# EAGLE design Oscillator Or Joystick Ambisonic Pan-Rotate (EAGLE 9.0.1)

## Sheet 1 of 4: SWINGER (1 OF 4) 1V/oct expo conv and the quad VCO
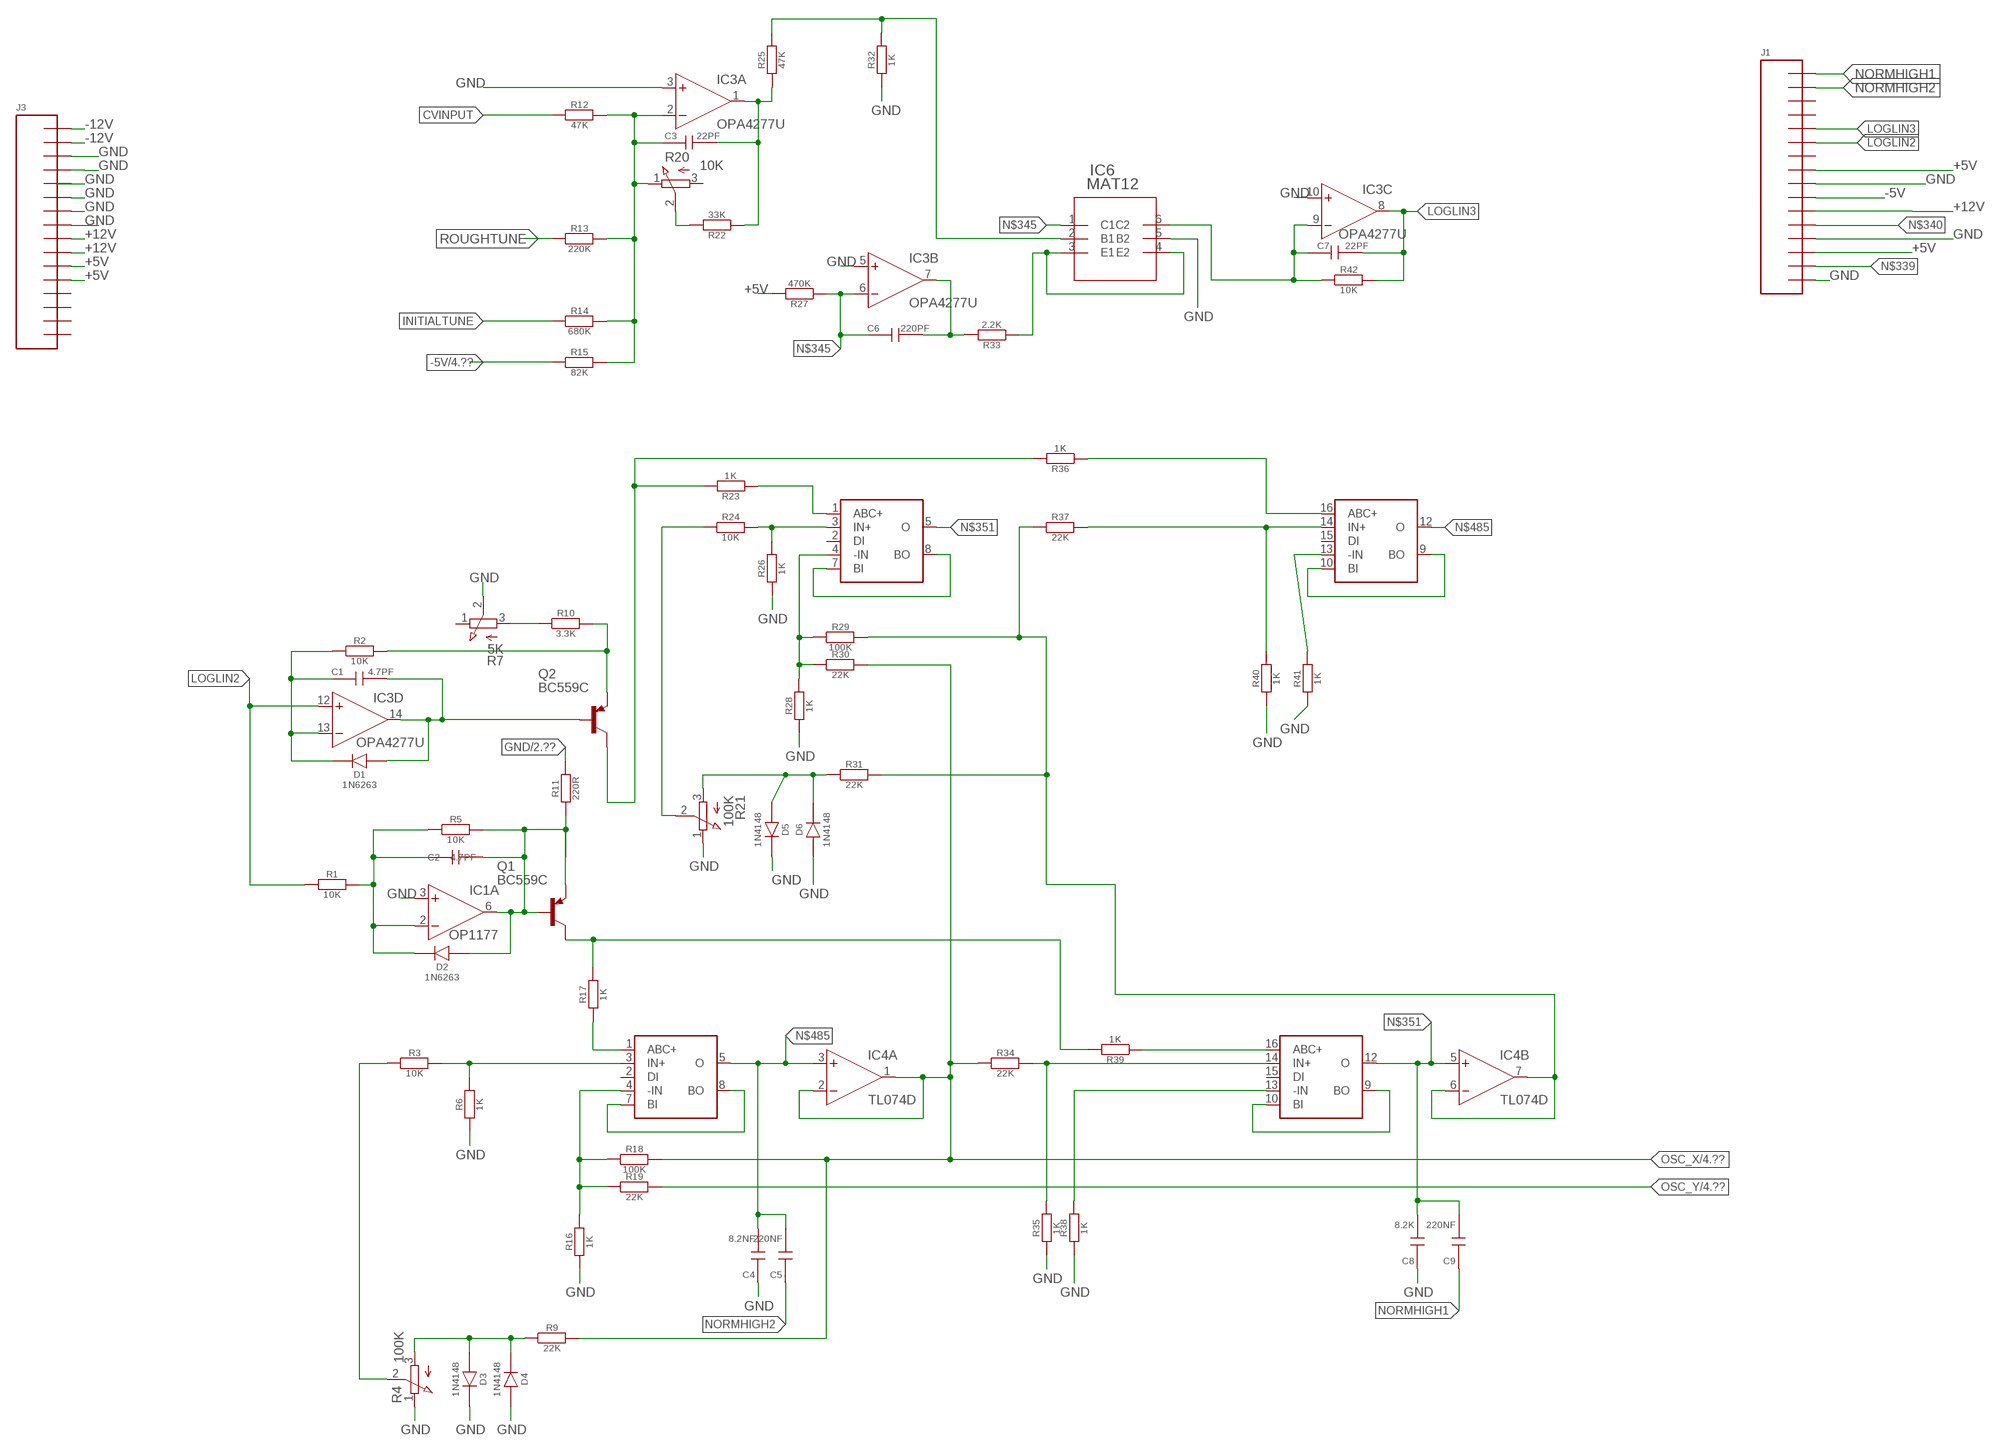
[diagram p0: schematic, sheet 1]

### Parts
C1  4.7PF  C  [CT6032]
C2  4.7PF  C  [CT6032]
C3  22PF  C  [CT6032]
C4  8.2NF  C  [CT6032]
C5  220NF  C  [CT6032]
C6  220PF  C  [CT6032]
C7  22PF  C  [CT6032]
C8  8.2K  C  [CT6032]
C9  220NF  C  [CT6032]
D1  1N6263  D  [SOD123]
D2  1N6263  D  [SOD123]
D3  1N4148  D  [SOD123]
D4  1N4148  D  [SOD123]
D5  1N4148  D  [SOD123]
D6  1N4148  D  [SOD123]
IC1  OP1177  [SO08]
IC2  LM13700  [SO16]
IC3  OPA4277U  [SO14]
IC4  TL074D  [SO14]
IC5  LM13700  [SO16]
IC6  MAT12  [H_6]
J1  CON_16  [2X08SMT]
J3  CON_16  [2X08SMT]
Q1  BC559C  [TO92]
Q2  BC559C  [TO92]
R1  10K  R  [R6332W]
R2  10K  R  [R6332W]
R3  10K  R  [R6332W]
R4  100K  TRIM  [TRIM]
R5  10K  R  [R6332W]
R6  1K  R  [R6332W]
R7  5K  TRIM  [TRIM]
R9  22K  R  [R6332W]
R10  3.3K  R  [R6332W]
R11  220R  R  [R6332W]
R12  47K  R  [R6332W]
R13  220K  R  [R6332W]
R14  680K  R  [R6332W]
R15  82K  R  [R6332W]
R16  1K  R  [R6332W]
R17  1K  R  [R6332W]
R18  100K  R  [R6332W]
R19  22K  R  [R6332W]
R20  10K  TRIM  [TRIM]
R21  100K  TRIM  [TRIM]
R22  33K  R  [R6332W]
R23  1K  R  [R6332W]
R24  10K  R  [R6332W]
R25  47K  R  [R6332W]
R26  1K  R  [R6332W]
R27  470K  R  [R6332W]
R28  1K  R  [R6332W]
R29  100K  R  [R6332W]
R30  22K  R  [R6332W]
R31  22K  R  [R6332W]
R32  1K  R  [R6332W]
R33  2.2K  R  [R6332W]
R34  22K  R  [R6332W]
R35  1K  R  [R6332W]
R36  1K  R  [R6332W]
R37  22K  R  [R6332W]
R38  1K  R  [R6332W]
R39  1K  R  [R6332W]
R40  1K  R  [R6332W]
R41  1K  R  [R6332W]
R42  10K  R  [R6332W]

### Nets
+5V: J1.8 J1.14 J3.11 J3.12 R27.2 ; also sheet 4
+12V: J1.11 J3.9 J3.10 ; also sheet 3,4
-5V: J1.10 R15.1 ; also sheet 4
-12V: J3.1 J3.2 ; also sheet 4
CVINPUT: R12.1
GND: C4.+ C8.+ D3.C D4.A D5.C D6.A IC1.3(A:+IN) IC3.3(A:+IN) IC3.5(B:+IN) IC3.10(C:+IN) IC6.5(B2) J1.9 J1.13 J1.16 J3.3 J3.4 J3.5 J3.6 J3.7 J3.8 R4.1(A) R6.1 R7.2(E) R11.2 R16.1 R21.1(A) R26.1 R28.1 R32.1 R35.1 R38.1 R40.1 R41.1 ; also sheet 2,3,4
INITIALTUNE: R14.1
LOGLIN2: IC3.12(D:+IN) J1.6 R1.1
LOGLIN3: C7.- IC3.8(C:OUT) J1.5 R42.2
N$283: C3.+ IC3.2(A:-IN) R12.2 R13.2 R14.2 R15.2 R20.1(A)
N$284: C3.- IC3.1(A:OUT) R22.1 R25.1
N$285: IC6.2(B1) R25.2 R32.2
N$286: C6.- IC3.7(B:OUT) R33.2
N$287: IC6.3(E1) IC6.4(E2) R33.1
N$290: C7.+ IC3.9(C:-IN) IC6.6(C2) R42.1
N$339: J1.15
N$340: J1.12
N$341: R20.2(E) R22.2
N$344: R7.3(S) R10.1
N$345: C6.+ IC3.6(B:-IN) IC6.1(C1) R27.1
N$347: R3.1 R4.2(E)
N$349: R21.2(E) R24.1
N$351: C8.- C9.- IC2.12(O) IC4.5(B:+IN) IC5.5(O)
N$380: C1.+ D1.C IC3.13(D:-IN) R2.1
N$384: C1.- D1.A IC3.14(D:OUT) Q2.B
N$399: C2.+ D2.C IC1.2(A:-IN) R1.2 R5.1
N$414: Q2.E R2.2 R10.2
N$418: C2.- D2.A IC1.6(A:OUT) Q1.B Q1.E R5.2 R11.1
N$419: Q2.C R23.2 R36.2
N$420: IC2.16(ABC+) R39.1
N$421: D3.A D4.C R4.3(S) R9.1
N$428: IC2.3(IN+) R3.2 R6.2
N$445: IC2.1(ABC+) R17.1
N$484: IC2.4(-IN) R16.2 R18.1 R19.1
N$485: C4.- C5.- IC2.5(O) IC4.3(A:+IN) IC5.12(O)
N$490: Q1.C R17.2 R39.2
N$491: IC2.7(BI) IC2.8(BO)
N$496: IC2.9(BO) IC2.10(BI)
N$514: IC2.14(IN+) R34.2 R35.2
N$532: IC2.13(-IN) R38.2
N$551: IC5.13(-IN) R41.2
N$575: IC5.3(IN+) R24.2 R26.2
N$577: IC5.4(-IN) R28.2 R29.1 R30.1
N$584: IC4.6(B:-IN) IC4.7(B:OUT) R29.2 R31.2 R37.1
N$596: IC5.9(BO) IC5.10(BI)
N$611: IC5.1(ABC+) R23.1
N$615: IC5.16(ABC+) R36.1
N$616: IC5.7(BI) IC5.8(BO)
N$617: IC5.14(IN+) R37.2 R40.2
N$618: D5.A D6.C R21.3(S) R31.1
NORMHIGH1: C9.+ J1.1
NORMHIGH2: C5.+ J1.2
OSC_X: IC4.1(A:OUT) IC4.2(A:-IN) R9.2 R18.2 R30.2 R34.1 ; also sheet 4
OSC_Y: R19.2 ; also sheet 4
ROUGHTUNE: R13.1
Unconnected: IC1.1(C:NC) IC1.5(D:NC) IC1.8(E:NC) IC2.2(DI) IC2.15(DI) IC4.8(C:OUT) IC4.9(C:-IN) IC4.10(C:+IN) IC4.12(D:+IN) IC4.13(D:-IN) IC4.14(D:OUT) IC5.2(DI) IC5.15(DI) J1.3 J1.4 J1.7 J3.13 J3.14 J3.15 J3.16 R7.1(A) R20.3(S)

## Sheet 2 of 4: SWINGER (2 OF 4) four precision current src to drive the OTA current inputs
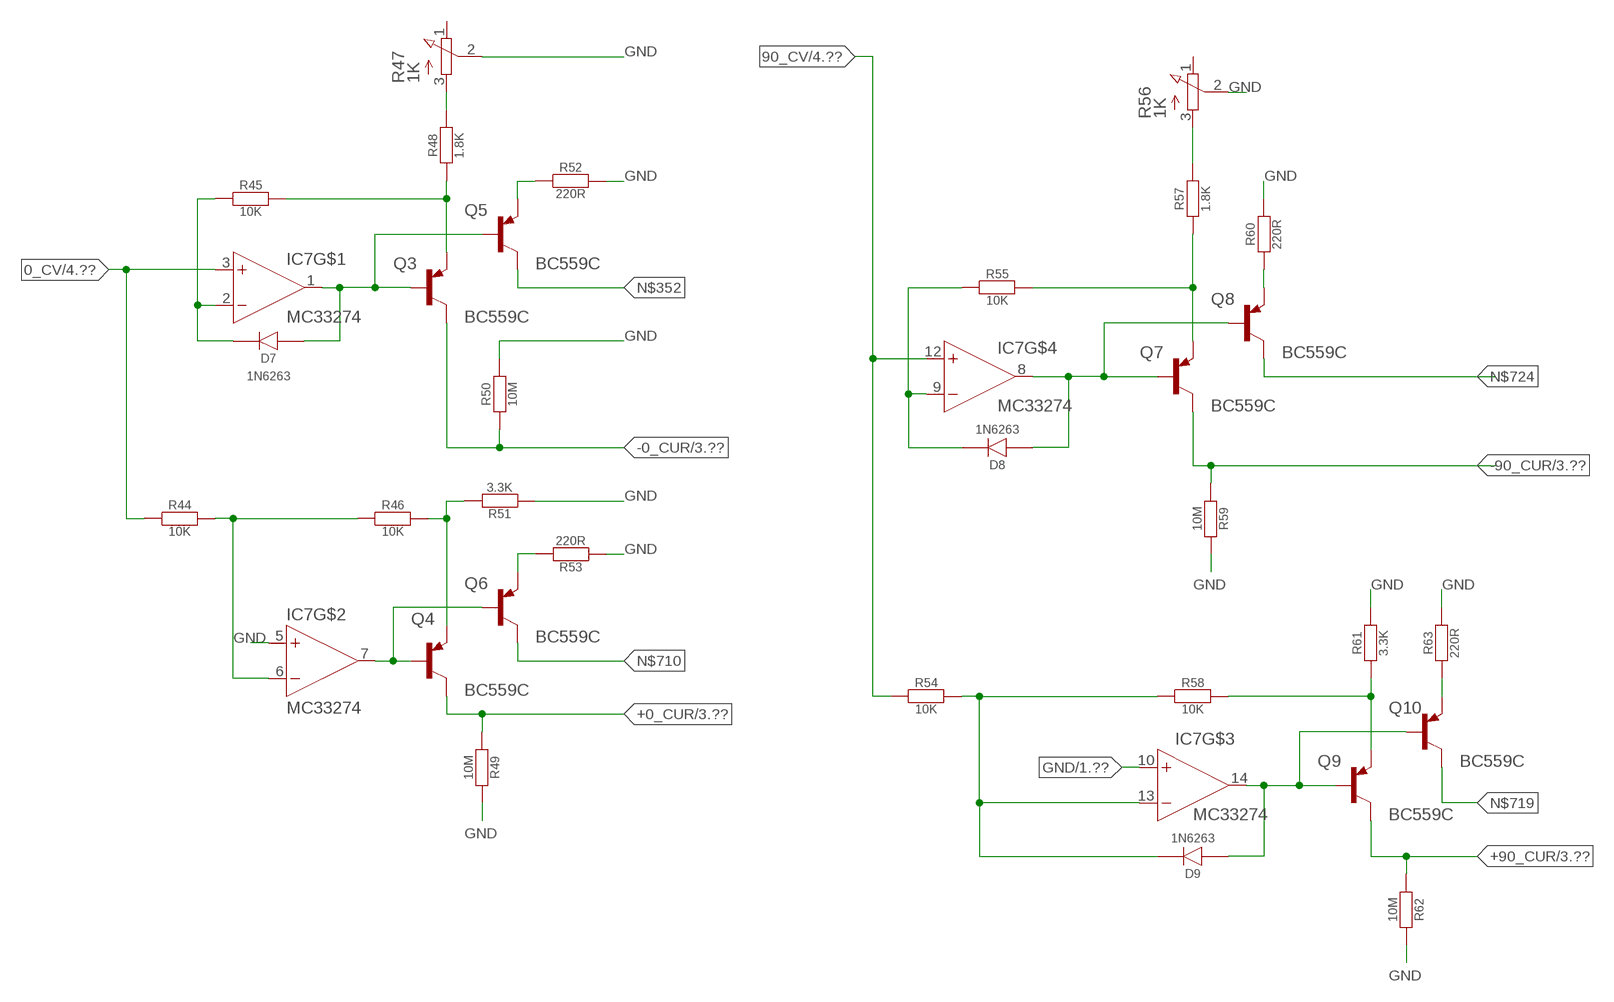
[diagram p1: schematic, sheet 2]

### Parts
D7  1N6263  D  [SOD123]
D8  1N6263  D  [SOD123]
D9  1N6263  D  [SOD123]
IC7  MC33274  [SO14]
Q3  BC559C  [TO92]
Q4  BC559C  [TO92]
Q5  BC559C  [TO92]
Q6  BC559C  [TO92]
Q7  BC559C  [TO92]
Q8  BC559C  [TO92]
Q9  BC559C  [TO92]
Q10  BC559C  [TO92]
R44  10K  R  [R6332W]
R45  10K  R  [R6332W]
R46  10K  R  [R6332W]
R47  1K  TRIM  [TRIM]
R48  1.8K  R  [R6332W]
R49  10M  R  [R6332W]
R50  10M  R  [R6332W]
R51  3.3K  R  [R6332W]
R52  220R  R  [R6332W]
R53  220R  R  [R6332W]
R54  10K  R  [R6332W]
R55  10K  R  [R6332W]
R56  1K  TRIM  [TRIM]
R57  1.8K  R  [R6332W]
R58  10K  R  [R6332W]
R59  10M  R  [R6332W]
R60  220R  R  [R6332W]
R61  3.3K  R  [R6332W]
R62  10M  R  [R6332W]
R63  220R  R  [R6332W]

### Nets
0_CV: IC7.3(+IN) R44.1 ; also sheet 4
90_CV: IC7.12(+IN) R54.1 ; also sheet 4
+0_CUR: Q4.C R49.1 ; also sheet 3
+90_CUR: Q9.C R62.1 ; also sheet 3
-0_CUR: Q3.C R50.1 ; also sheet 3
-90_CUR: Q7.C R59.1 ; also sheet 3
GND: IC7.5(+IN) IC7.10(+IN) R47.2(E) R49.2 R50.2 R51.1 R52.2 R53.1 R56.2(E) R59.2 R60.2 R61.2 R62.2 R63.2 ; also sheet 1,3,4
N$348: Q5.E R52.1
N$352: Q5.C
N$353: R56.3(S) R57.2
N$698: IC7.6(-IN) R44.2 R46.1
N$701: IC7.7(OUT) Q4.B Q6.B
N$702: Q4.E R46.2 R51.2
N$703: Q6.E R53.2
N$704: D7.A IC7.1(OUT) Q3.B Q5.B
N$705: R47.3(S) R48.2
N$706: D7.C IC7.2(-IN) R45.1
N$708: Q3.E R45.2 R48.1
N$710: Q6.C
N$711: D9.C IC7.13(-IN) R54.2 R58.1
N$712: D9.A IC7.14(OUT) Q9.B Q10.B
N$716: Q9.E R58.2 R61.1
N$717: Q10.E R63.1
N$719: Q10.C
N$720: D8.C IC7.9(-IN) R55.1
N$721: D8.A IC7.8(OUT) Q7.B Q8.B
N$722: Q7.E R55.2 R57.1
N$724: Q8.C
N$725: Q8.E R60.1
Unconnected: R47.1(A) R56.1(A)

## Sheet 3 of 4: SWINGER (3 Of 4) VCAs which provide the X-Y multiplication of the mono input signal
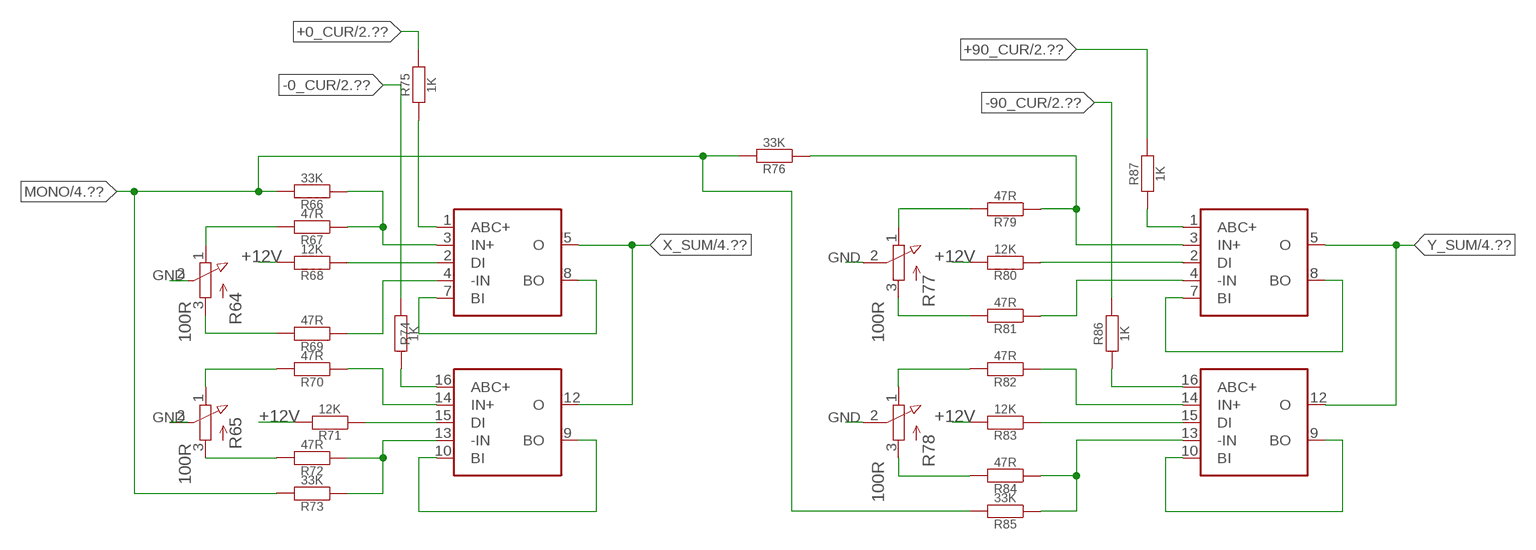
[diagram p2: schematic, sheet 3]

### Parts
IC8  LM13700  [SO16]
IC9  LM13700  [SO16]
R64  100R  TRIM  [TRIM]
R65  100R  TRIM  [TRIM]
R66  33K  R  [R6332W]
R67  47R  R  [R6332W]
R68  12K  R  [R6332W]
R69  47R  R  [R6332W]
R70  47R  R  [R6332W]
R71  12K  R  [R6332W]
R72  47R  R  [R6332W]
R73  33K  R  [R6332W]
R74  1K  R  [R6332W]
R75  1K  R  [R6332W]
R76  33K  R  [R6332W]
R77  100R  TRIM  [TRIM]
R78  100R  TRIM  [TRIM]
R79  47R  R  [R6332W]
R80  12K  R  [R6332W]
R81  47R  R  [R6332W]
R82  47R  R  [R6332W]
R83  12K  R  [R6332W]
R84  47R  R  [R6332W]
R85  33K  R  [R6332W]
R86  1K  R  [R6332W]
R87  1K  R  [R6332W]

### Nets
+0_CUR: R75.2 ; also sheet 2
+12V: R68.2 R71.2 R80.2 R83.2 ; also sheet 1,4
+90_CUR: R87.2 ; also sheet 2
-0_CUR: R74.2 ; also sheet 2
-90_CUR: R86.2 ; also sheet 2
GND: R64.2(E) R65.2(E) R77.2(E) R78.2(E) ; also sheet 1,2,4
MONO: R66.2 R73.2 R76.2 R85.2 ; also sheet 4
N$668: IC8.1(ABC+) R75.1
N$669: IC8.16(ABC+) R74.1
N$670: IC8.3(IN+) R66.1 R67.1
N$671: IC8.2(DI) R68.1
N$672: IC8.4(-IN) R69.1
N$673: IC8.7(BI) IC8.8(BO)
N$675: IC8.9(BO) IC8.10(BI)
N$676: IC8.14(IN+) R70.1
N$677: IC8.15(DI) R71.1
N$678: IC8.13(-IN) R72.1 R73.1
N$679: R65.3(S) R72.2
N$680: R65.1(A) R70.2
N$682: R64.3(S) R69.2
N$683: R64.1(A) R67.2
N$684: R77.3(S) R81.2
N$685: R77.1(A) R79.2
N$686: R78.3(S) R84.2
N$687: R78.1(A) R82.2
N$688: IC9.14(IN+) R82.1
N$689: IC9.13(-IN) R84.1 R85.1
N$690: IC9.15(DI) R83.1
N$691: IC9.16(ABC+) R86.1
N$692: IC9.4(-IN) R81.1
N$693: IC9.3(IN+) R76.1 R79.1
N$694: IC9.2(DI) R80.1
N$695: IC9.7(BI) IC9.8(BO)
N$696: IC9.9(BO) IC9.10(BI)
N$699: IC9.1(ABC+) R87.1
X_SUM: IC8.5(O) IC8.12(O) ; also sheet 4
Y_SUM: IC9.5(O) IC9.12(O) ; also sheet 4

## Sheet 4 of 4: SWINGER (4 OF 4) auxilliary circuits common to all sections
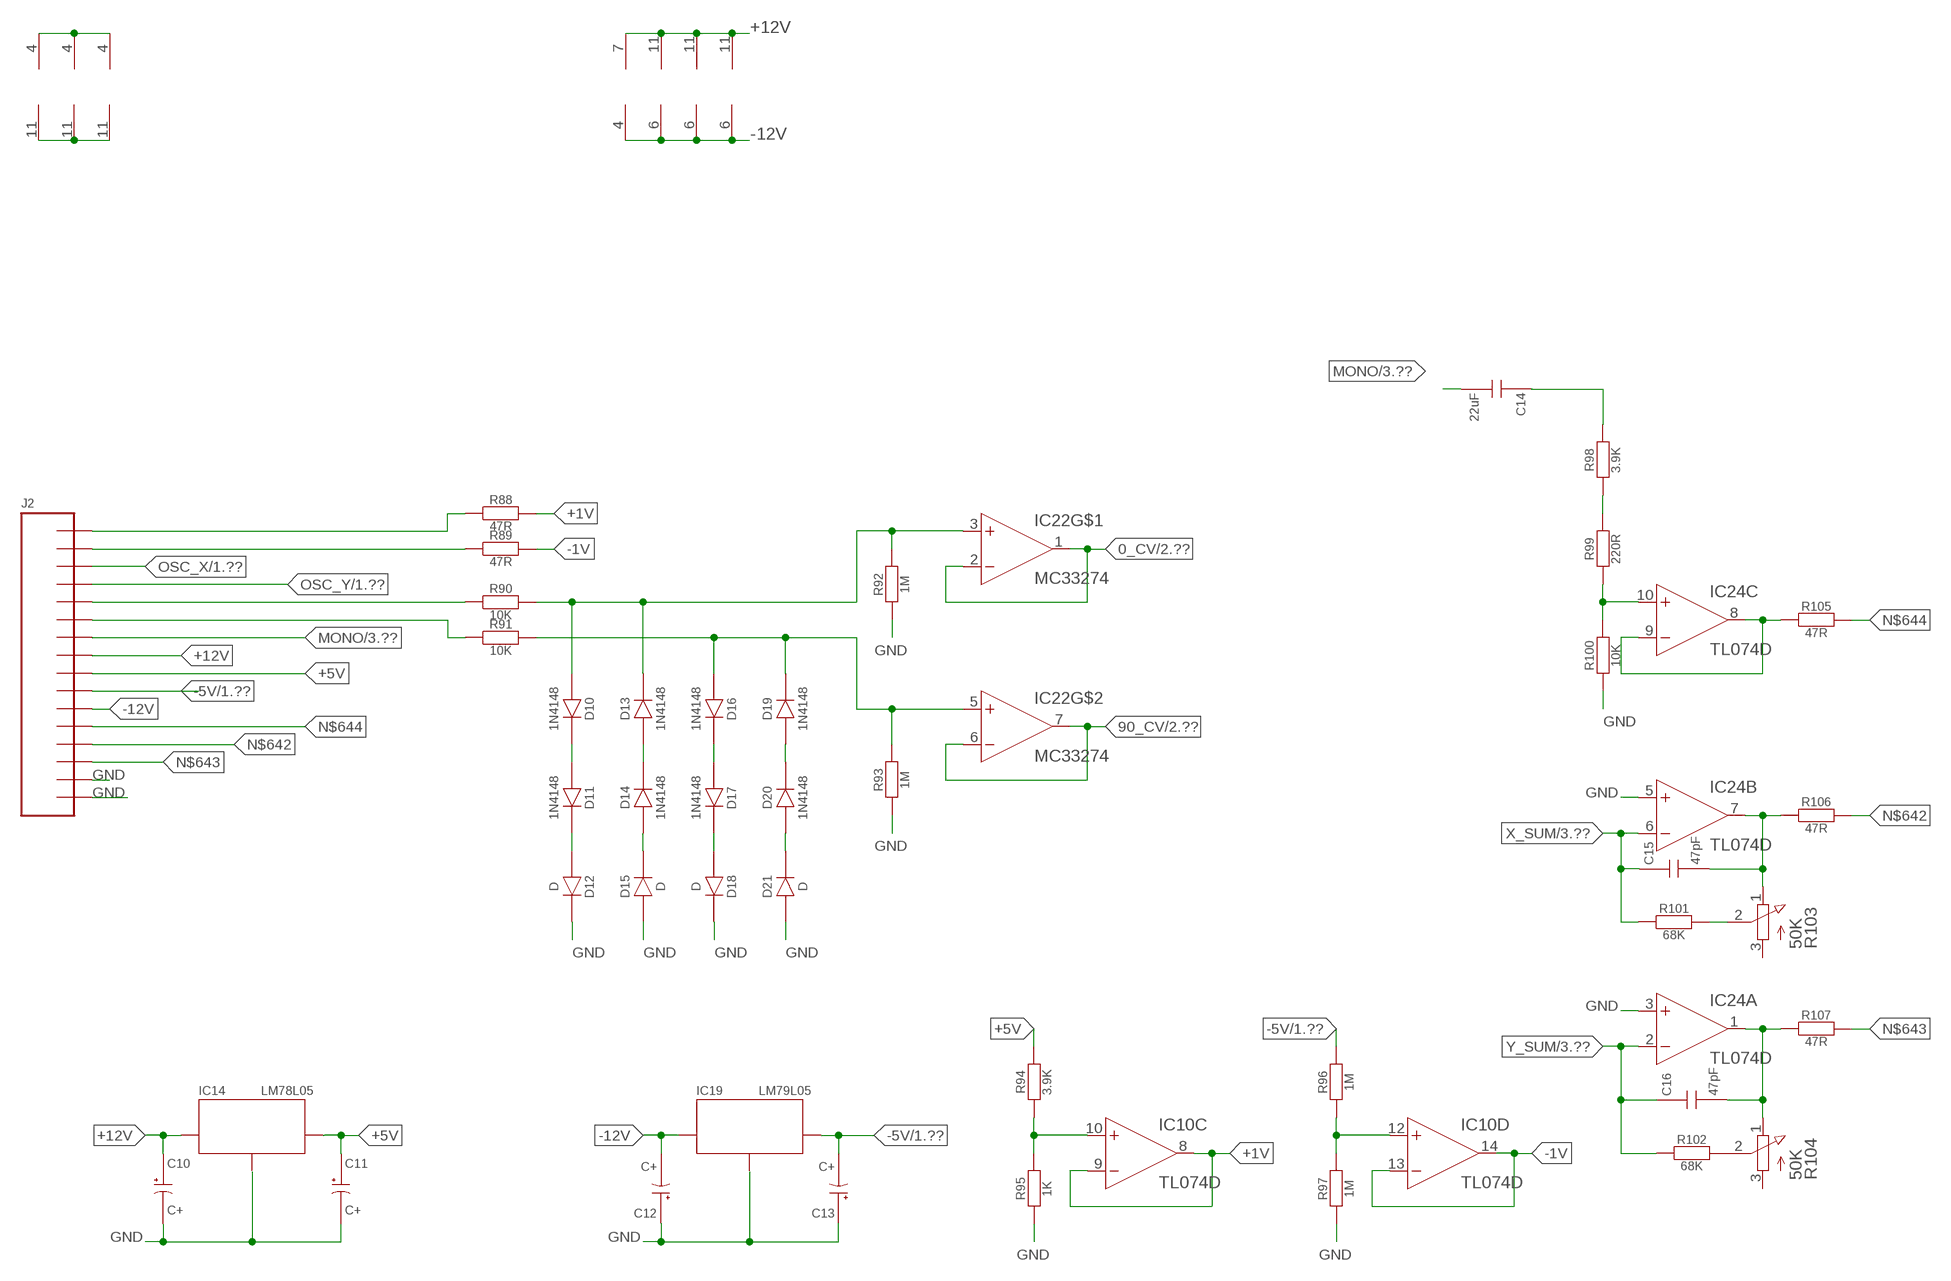
[diagram p3: schematic, sheet 4]

### Parts
C10  C+  [PANASONIC_E]
C11  C+  [PANASONIC_E]
C12  C+  [PANASONIC_E]
C13  C+  [PANASONIC_E]
C14  22uF  C  [CT6032]
C15  47pF  C  [CT6032]
C16  47pF  C  [CT6032]
D10  1N4148  D  [SOD123]
D11  1N4148  D  [SOD123]
D12  D  [SOD123]
D13  1N4148  D  [SOD123]
D14  1N4148  D  [SOD123]
D15  D  [SOD123]
D16  1N4148  D  [SOD123]
D17  1N4148  D  [SOD123]
D18  D  [SOD123]
D19  1N4148  D  [SOD123]
D20  1N4148  D  [SOD123]
D21  D  [SOD123]
IC10  TL074D  [SO14]
IC14  LM78L05  VREG  [SO08]
IC19  LM79L05  VREG  [SO08]
IC22  MC33274  [SO14]
IC24  TL074D  [SO14]
J2  CON_16  [2X08SMT]
R88  47R  R  [R6332W]
R89  47R  R  [R6332W]
R90  10K  R  [R6332W]
R91  10K  R  [R6332W]
R92  1M  R  [R6332W]
R93  1M  R  [R6332W]
R94  3.9K  R  [R6332W]
R95  1K  R  [R6332W]
R96  1M  R  [R6332W]
R97  1M  R  [R6332W]
R98  3.9K  R  [R6332W]
R99  220R  R  [R6332W]
R100  10K  R  [R6332W]
R101  68K  R  [R6332W]
R102  68K  R  [R6332W]
R103  50K  TRIM  [TRIM]
R104  50K  TRIM  [TRIM]
R105  47R  R  [R6332W]
R106  47R  R  [R6332W]
R107  47R  R  [R6332W]

### Nets
0_CV: IC22.1(OUT) IC22.2(-IN) ; also sheet 2
90_CV: IC22.6(-IN) IC22.7(OUT) ; also sheet 2
+1V: IC10.8(C:OUT) IC10.9(C:-IN) R88.2
+5V: C11.+ IC14.1(OUT) J2.9 R94.2 ; also sheet 1
+12V: C10.+ IC1.7(B:V+) IC3.4(E:V+) IC5.11(V+) IC7.4(V+) IC8.11(V+) IC9.11(V+) IC14.8(IN) IC24.4(P:V+) J2.8 ; also sheet 1,3
-1V: IC10.13(D:-IN) IC10.14(D:OUT) R89.2
-5V: C13.- IC19.1(OUT) J2.10 R96.2 ; also sheet 1
-12V: C12.- IC1.4(B:V-) IC3.11(E:V-) IC5.6(V-) IC7.11(V-) IC8.6(V-) IC9.6(V-) IC19.8(IN) IC24.11(P:V-) J2.11 ; also sheet 1
GND: C10.- C11.- C12.+ C13.+ D12.C D15.A D18.C D21.A IC14.2(GND) IC14.3(GND) IC14.6(GND) IC14.7(GND) IC19.2(GND) IC19.3(GND) IC19.6(GND) IC19.7(GND) IC24.3(A:+IN) IC24.5(B:+IN) J2.15 J2.16 R92.1 R93.1 R95.1 R97.1 R100.1 ; also sheet 1,2,3
MONO: C14.- J2.7 ; also sheet 3
N$1: C14.+ R98.2
N$350: R98.1 R99.2
N$356: C15.- IC24.7(B:OUT) R103.1(A) R106.1
N$357: IC10.10(C:+IN) R94.1 R95.2
N$358: J2.1 R88.1
N$359: IC10.12(D:+IN) R96.1 R97.2
N$362: J2.2 R89.1
N$363: J2.5 R90.1
N$364: J2.6 R91.1
N$621: IC24.10(C:+IN) R99.1 R100.2
N$622: IC24.8(C:OUT) IC24.9(C:-IN) R105.1
N$641: R101.2 R103.2(E)
N$642: J2.13 R106.2
N$643: J2.14 R107.2
N$644: J2.12 R105.2
N$645: C16.- IC24.1(A:OUT) R104.1(A) R107.1
N$646: D10.C D11.A
N$648: R102.2 R104.2(E)
N$651: D11.C D12.A
N$652: D13.A D14.C
N$653: D14.A D15.C
N$654: D17.C D18.A
N$655: D16.C D17.A
N$656: D20.A D21.C
N$657: D19.A D20.C
N$658: D10.A D13.C IC22.3(+IN) R90.2 R92.2
N$659: D16.A D19.C IC22.5(+IN) R91.2 R93.2
OSC_X: J2.3 ; also sheet 1
OSC_Y: J2.4 ; also sheet 1
X_SUM: C15.+ IC24.6(B:-IN) R101.1 ; also sheet 3
Y_SUM: C16.+ IC24.2(A:-IN) R102.1 ; also sheet 3
Unconnected: IC10.1(A:OUT) IC10.2(A:-IN) IC10.3(A:+IN) IC10.5(B:+IN) IC10.6(B:-IN) IC10.7(B:OUT) IC22.8(OUT) IC22.9(-IN) IC22.10(+IN) IC22.12(+IN) IC22.13(-IN) IC22.14(OUT) IC24.12(D:+IN) IC24.13(D:-IN) IC24.14(D:OUT) R103.3(S) R104.3(S)

## Power pins joined to a net without a drawn wire
+12V: IC2.11(V+) IC4.4(P:V+) IC10.4(P:V+) IC22.4(V+)
-12V: IC2.6(V-) IC4.11(P:V-) IC10.11(P:V-) IC22.11(V-)

## Library data of the parts
C1-C9 C14-C16 = SMD:C
C10-C13 = SMD:C+
D1-D21 = SMD:D
IC1 = SMD:OP1177: Precision Low Noise, Low Input Bias Current Operational Amplifiers Source: OP1177_2177_4177.pdf
IC2 IC5 IC8 IC9 = SMD:LM13700
IC3 = SMD:OPA4277: High Precision OPERATIONAL AMPLIFIERS REPLACES OP-07, OP-77, OP-177 Source: opa277.pdf
IC4 IC10 IC24 = SMD:TL074: OP AMP
IC6 = SMD:MAT12; MANUFACTURER_PART_NUMBER: MAT12AHZ; VENDOR: Analog Devices Inc
IC7 IC22 = SMD:MC33274
IC14 IC19 = SMD:VREG
J1-J3 = SMD:CON_16
Q1-Q10 = SMD:BC559: PNP Transistror
R1-R3 R5 R6 R9-R19 R22-R42 R44-R46 R48-R55 R57-R63 R66-R76 R79-R102 R105-R107 = SMD:R
R4 R7 R20 R21 R47 R56 R64 R65 R77 R78 R103 R104 = SMD:TRIM

## Board
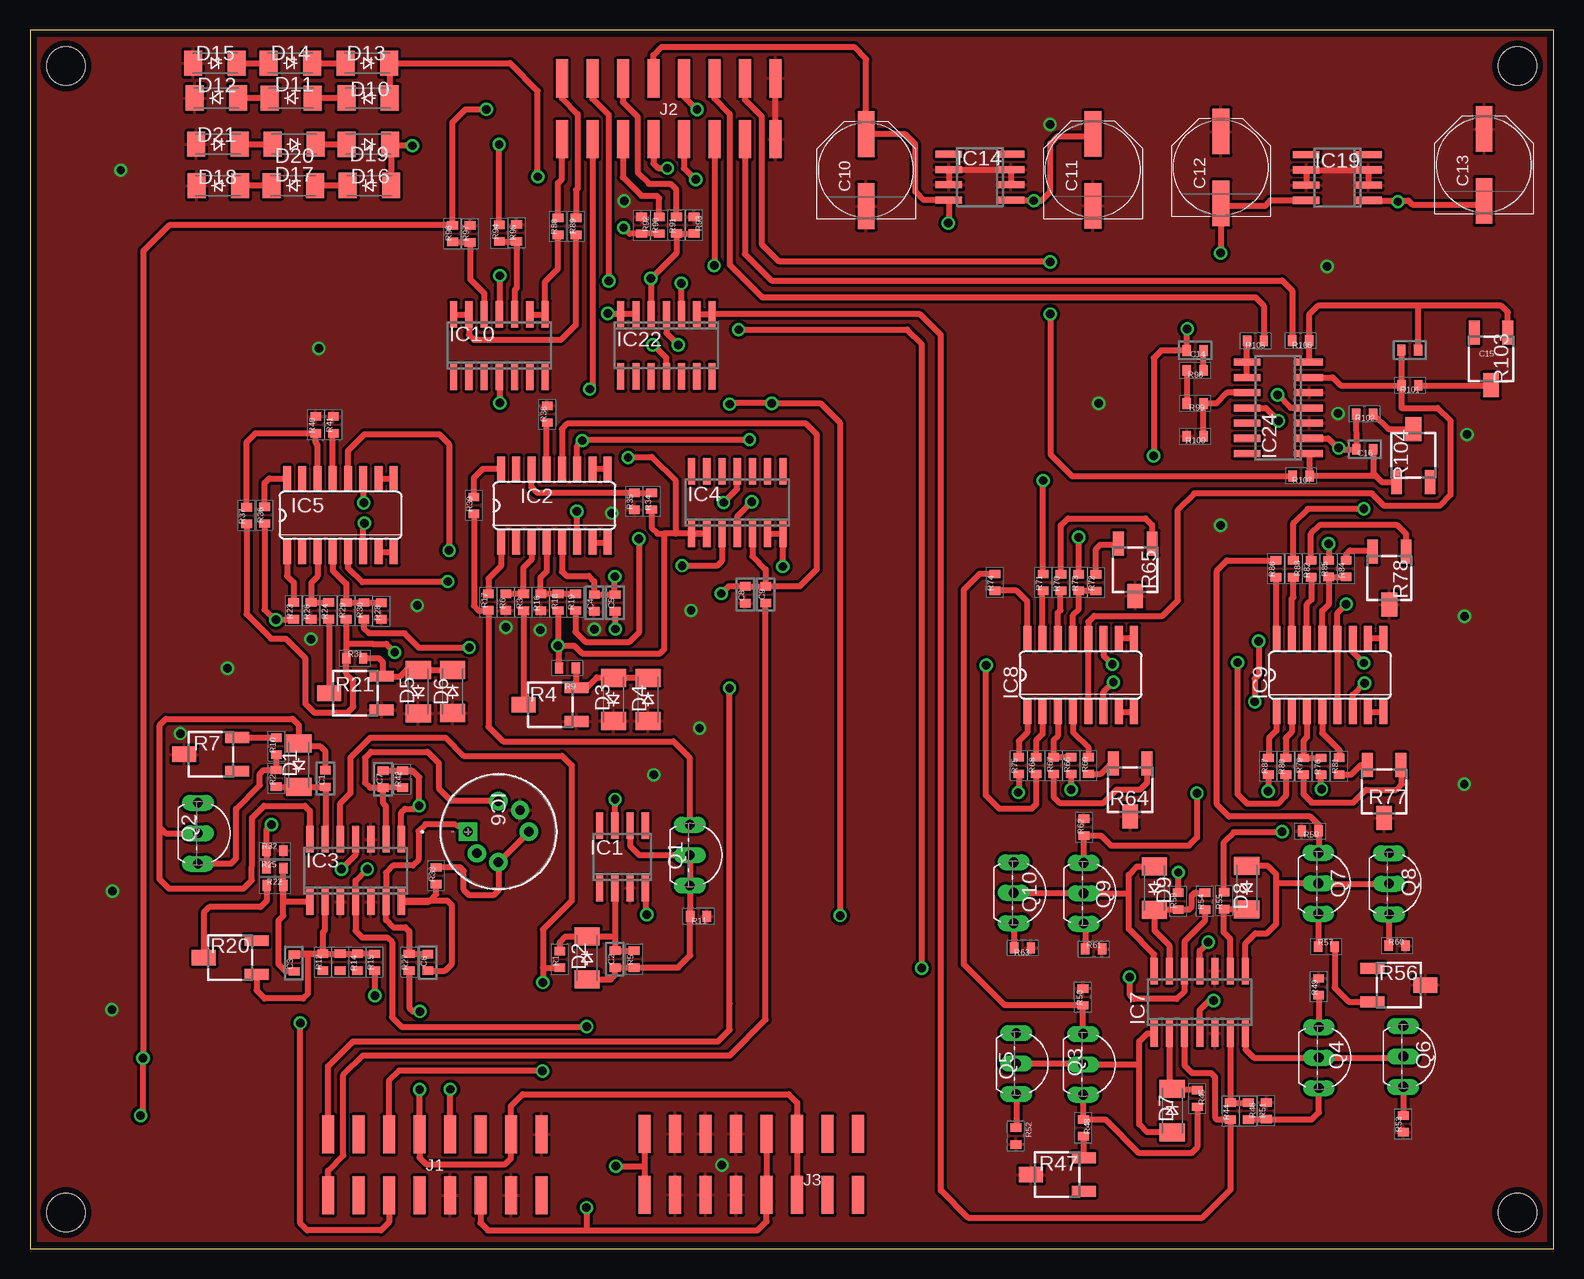
[diagram p4: board, top side]
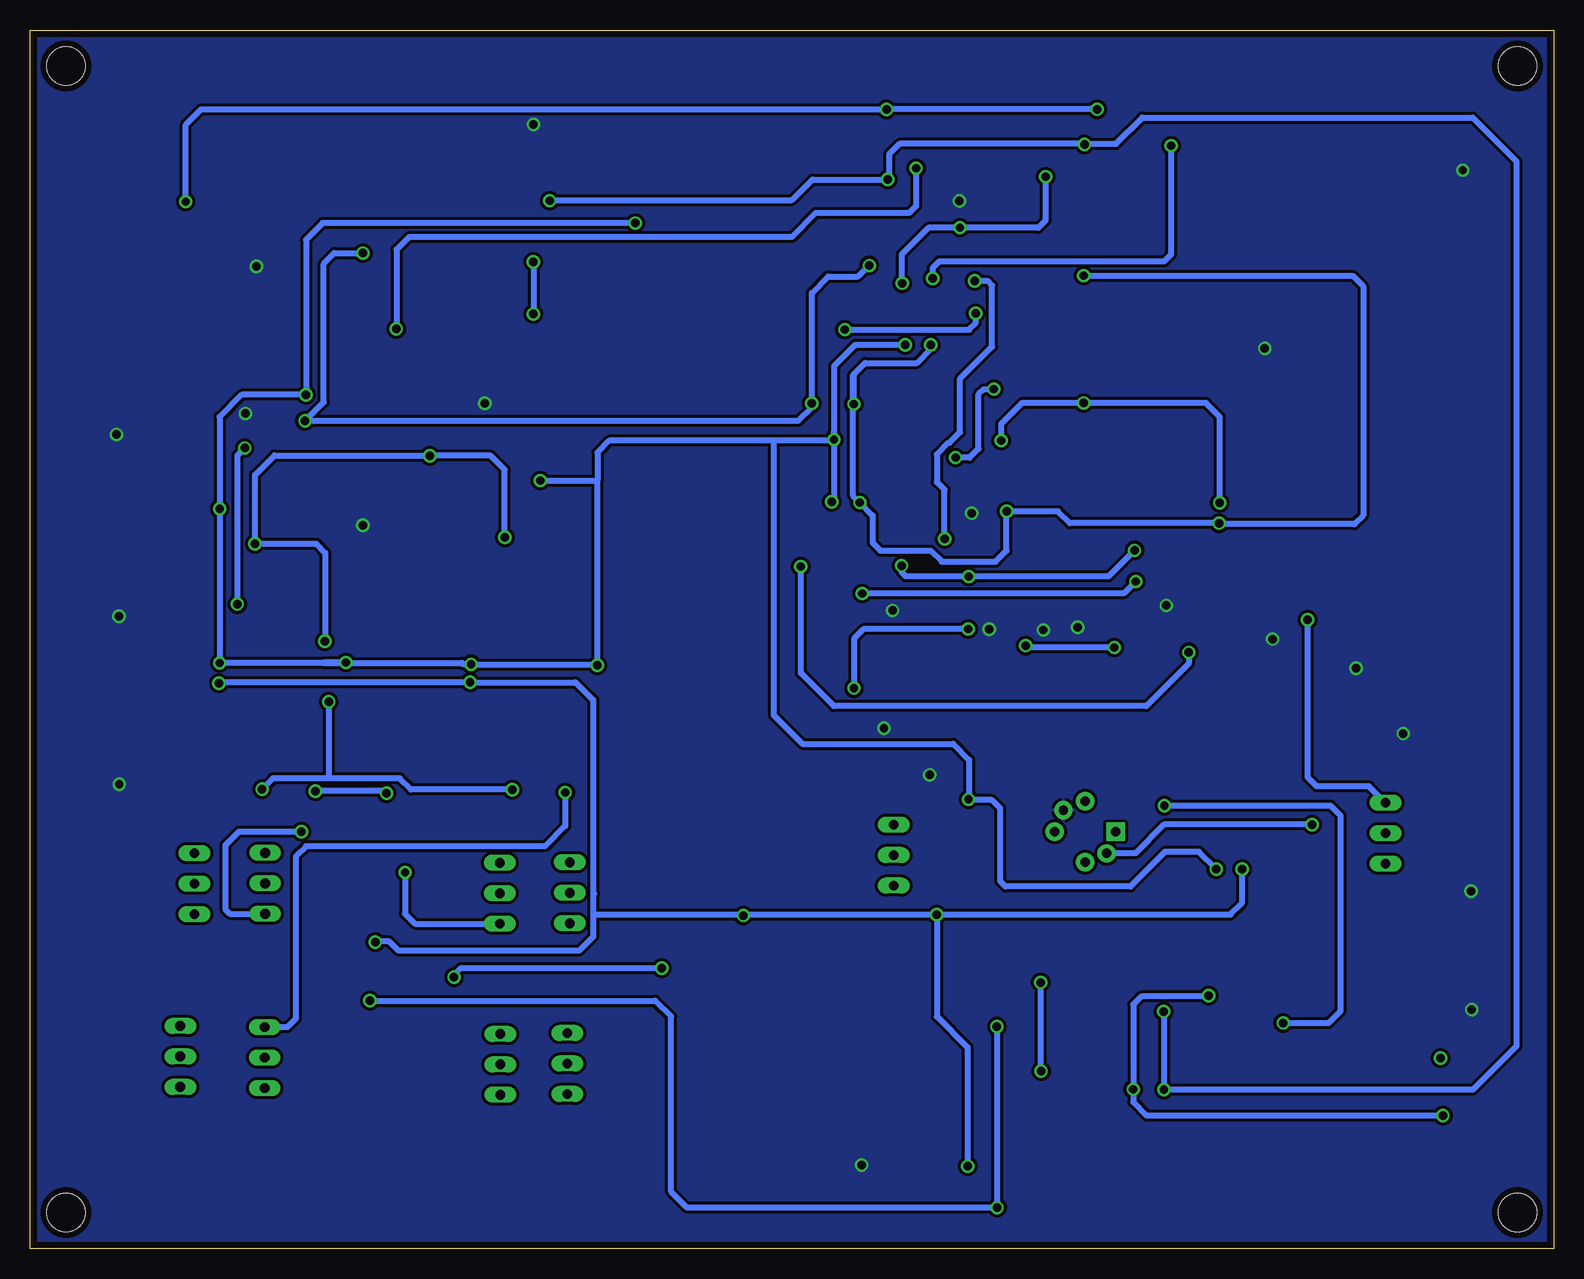
[diagram p5: board, bottom side, seen from below]

Size 127 x 101.6 mm. Coordinates in mm from the lower left corner, seen from the top.
Outline: 0,0 127,0 127,101.6 0,101.6 0,0
Copper layers (1*16): Top 0.035mm / dielectric 1.5mm / Bottom 0.035mm
Design rules "default *": minimum track width 3mil, minimum drill 0.35mm, track to track 10mil, track to pad 15mil, pad to pad 10mil, via to via 8mil, smd to smd 6mil, copper to edge 20mil, drill to drill 6mil, minimum pad ring 10mil, minimum via ring 8mil, stop-mask expansion 4mil, vias tented up to drill 0mil, thermal gap 10mil
Holes 3.2 mm at 3,3 3,98.6 124,98.6 124,3

### Footprints (pad centres in the part's own frame; a part is rotated, then mirrored left to right if it is on the bottom)
CT6032 = smd 0.7 x 0.9: + -0.7,0; - 0.7,0
PANASONIC_E = smd 3.8 x 1.4: + 3,0; - -3,0
SOD123 = smd 1.5 x 2.1: A 1.8,0; C -1.8,0
SO08 = smd 0.6 x 2.2: 1 -1.905,-2.6; 2 -0.635,-2.6; 3 0.635,-2.6; 4 1.905,-2.6; 5 1.905,2.6; 6 0.635,2.6; 7 -0.635,2.6; 8 -1.905,2.6
SO16 = smd 0.66 x 2.032: 1 -4.445,-3.073; 2 -3.175,-3.073; 3 -1.905,-3.073; 4 -0.635,-3.073; 5 0.635,-3.073; 6 1.905,-3.073; 7 3.175,-3.073; 8 4.445,-3.073; 9 4.445,3.073; 10 3.175,3.073; 11 1.905,3.073; 12 0.635,3.073; 13 -0.635,3.073; 14 -1.905,3.073; 15 -3.175,3.073; 16 -4.445,3.073
SO14 = smd 0.6 x 2.2: 1 -3.81,-2.6; 2 -2.54,-2.6; 3 -1.27,-2.6; 4 0,-2.6; 5 1.27,-2.6; 6 2.54,-2.6; 7 3.81,-2.6; 8 3.81,2.6; 9 2.54,2.6; 10 1.27,2.6; 11 0,2.6; 12 -1.27,2.6; 13 -2.54,2.6; 14 -3.81,2.6
H_6 = drill 0.787 pad 1.524 square: 1 0,-5.08 | drill 0.787 pad 1.524: 2 1.803,-4.343; 3 2.54,-2.54; 4 0,0; 5 -1.803,-0.737; 6 -2.54,-2.54
2X08SMT = smd 1 x 3.17: 1 -8.89,-2.54; 2 -8.89,2.54; 3 -6.35,-2.54; 4 -6.35,2.54; 5 -3.81,-2.54; 6 -3.81,2.54; 7 -1.27,-2.54; 8 -1.27,2.54; 9 1.27,-2.54; 10 1.27,2.54; 11 3.81,-2.54; 12 3.81,2.54; 13 6.35,-2.54; 14 6.35,2.54; 15 8.89,-2.54; 16 8.89,2.54
TO92 = drill 0.813 long: B 0,-1.27; C -2.54,-1.27; E 2.54,-1.27
R6332W = smd 0.7 x 0.9: 1 -0.7,0; 2 0.7,0
TRIM = smd 2 x 0.9: 1 -2.2,1.4; 3 -2.2,-1.4 | smd 2 x 1.3: 2 2.2,0

### Placement (x,y rotation side)
C1  24.63,39.2 90 top
C2  48.76,24.15 270 top
C3  22.01,23.82 270 top
C4  47.04,53.84 90 top
C5  48.77,53.84 90 top
C6  33.17,23.87 270 top
C7  29.44,39.14 90 top
C8  59.62,54.52 90 top
C9  61.33,54.53 90 top
C10  69.7,89.91 90 top
C11  88.61,89.94 90 top
C12  99.28,90.14 90 top
C13  121.21,90.35 90 top
C14  97.13,74.88 180 top
C15  115.01,74.91 0 top
C16  111.26,66.64 0 top
D1  22.41,40.31 90 top
D2  46.44,24.24 270 top
D3  48.64,45.8 90 top
D4  51.52,45.79 270 top
D5  32.37,46.44 90 top
D6  35.23,46.45 270 top
D7  95.21,11.51 270 top
D8  101.42,30.1 90 top
D9  93.74,30.06 90 top
D10  28.19,95.93 0 top
D11  21.78,95.92 0 top
D12  15.54,95.93 0 top
D13  28.12,98.83 180 top
D14  21.71,98.84 180 top
D15  15.42,98.83 180 top
D16  28.29,88.64 0 top
D17  21.95,88.63 0 top
D18  15.7,88.62 0 top
D19  28.21,92.06 180 top
D20  22.01,92.08 180 top
D21  15.67,92.07 180 top
IC1  49.39,32.66 0 top
IC2  43.71,61.95 0 top
IC3  27.14,31.53 0 top
IC4  58.95,62.2 0 top
IC5  25.88,61.15 0 top
IC6  41.59,34.76 270 top
IC7  97.51,20.55 0 top
IC8  87.58,47.83 0 top
IC9  108.36,47.82 0 top
IC10  39.13,75.29 0 top
IC14  79.19,89.33 90 top
IC19  108.98,89.29 90 top
IC22  53.05,75.31 180 top
IC24  104.05,70.09 90 top
J1  33.74,6.99 0 top
J2  53.24,95.02 0 top
J3  60.13,7.03 0 top
Q1  56.28,32.81 270 top
Q2  15.28,34.64 270 top
Q3  89.07,15.37 270 top
Q4  108.71,15.93 270 top
Q5  83.48,15.44 270 top
Q6  115.74,16.03 270 top
Q7  108.67,30.46 270 top
Q8  114.56,30.43 270 top
Q9  89.11,29.63 270 top
Q10  83.28,29.67 270 top
R1  44.17,24.12 90 top
R2  20.53,39.21 90 top
R3  41.14,53.89 90 top
R4  43.36,45.36 180 top
R5  50.36,24.14 270 top
R6  39.67,53.91 90 top
R7  15.07,41.21 180 top
R9  44.8,48.41 180 top
R10  20.54,41.89 270 top
R11  55.73,27.71 0 top
R12  24.42,23.9 90 top
R13  25.86,23.89 90 top
R14  27.29,23.89 90 top
R15  28.73,23.88 90 top
R16  42.59,53.89 90 top
R17  38.21,53.91 270 top
R18  44.03,53.9 270 top
R19  45.47,53.9 270 top
R20  16.69,24.28 180 top
R21  27.12,46.32 180 top
R22  20.43,30.28 180 top
R23  21.98,53.18 270 top
R24  24.9,53.18 90 top
R25  20.42,31.73 180 top
R26  23.44,53.19 90 top
R27  31.61,23.88 270 top
R28  29.29,53.16 90 top
R29  26.36,53.17 270 top
R30  27.83,53.17 270 top
R31  27.07,49.23 180 top
R32  20.41,33.19 180 top
R33  33.85,31.09 270 top
R34  51.82,62.32 90 top
R35  50.38,62.31 90 top
R36  19.56,61.15 270 top
R37  18.05,61.12 90 top
R38  43.12,69.57 270 top
R39  37,61.96 270 top
R40  23.83,68.69 270 top
R41  25.29,68.68 270 top
R42  31.05,39.15 90 top
R44  100.07,11.48 90 top
R45  97.3,12.53 270 top
R46  101.55,11.48 270 top
R47  85.64,6.18 180 top
R48  87.8,10.08 270 top
R49  107.42,21.84 90 top
R50  87.76,20.99 90 top
R51  103.05,11.5 270 top
R52  82.18,9.4 270 top
R53  114.47,10.41 90 top
R54  97.93,28.97 90 top
R55  99.54,29.01 90 top
R56  114.1,21.98 0 top
R57  108.06,25.18 0 top
R58  95.71,28.97 90 top
R59  106.72,34.82 180 top
R60  113.95,25.26 0 top
R61  88.67,24.99 0 top
R62  87.86,35.14 90 top
R63  82.74,25.08 0 top
R64  91.71,38.25 270 top
R65  92.14,56.6 270 top
R66  86.79,40.28 270 top
R67  85.33,40.28 270 top
R68  83.87,40.28 270 top
R69  88.23,40.28 270 top
R70  85.93,55.54 90 top
R71  84.45,55.55 90 top
R72  88.86,55.53 90 top
R73  87.42,55.54 90 top
R74  80.43,55.55 90 top
R75  82.42,40.28 270 top
R76  107.62,40.21 270 top
R77  112.88,38.12 270 top
R78  113.31,55.91 270 top
R79  106.15,40.21 270 top
R80  104.68,40.21 270 top
R81  109.13,40.23 270 top
R82  106.79,56.69 90 top
R83  105.32,56.68 90 top
R84  109.71,56.7 90 top
R85  108.25,56.7 90 top
R86  103.85,56.68 90 top
R87  103.22,40.21 270 top
R88  44.01,85.23 270 top
R89  45.52,85.22 270 top
R90  52.45,85.32 270 top
R91  53.89,85.33 270 top
R92  50.99,85.32 270 top
R93  55.35,85.33 270 top
R94  39.12,84.66 90 top
R95  40.57,84.68 270 top
R96  35.22,84.62 90 top
R97  36.69,84.6 270 top
R98  97.12,73.22 0 top
R99  97.13,70.46 180 top
R100  97.12,67.73 0 top
R101  115.03,71.97 0 top
R102  111.25,69.59 0 top
R103  121.79,74.19 270 top
R104  115.31,66.13 90 top
R105  102.15,75.69 0 top
R106  105.92,75.7 180 top
R107  105.96,64.42 180 top

### Tracks (layer width: path | path; a pad name or v marks a point on that pad's centre or on a via)
0_CV
  Top 0.5: IC22.2 IC22.1 74.19,77.91 75.92,76.17 75.92,4.87 78.19,2.6 97.74,2.6 100.07,4.93 R44.1 98.93,10.78 98.79,10.92 98.79,14.31 98.44,14.66 96.87,14.66 96.24,15.29 IC7.3
90_CV  (via drill 0.7)
  Top 0.5: R54.1 97.93,27.32 96.24,25.63 IC7.12 96.24,21.47 95.58,20.81 92.03,20.81 91.7,21.14 91.7,22.59 | 91.7,22.59 91.7,22.75 | v91.65,22.64 91.7,22.59 | IC22.6 IC22.7 48.22,77.91 v48.16,77.97 | v74.34,23.39 74.34,75.41 73.11,76.64 59.16,76.64 59.14,76.62 v59.07,76.62
  Bottom 0.5: v74.34,23.39 91.1,23.39 91.71,22.78 91.71,22.7 v91.65,22.64 | v59.07,76.62 48.71,76.62 48.15,77.18 48.15,77.65 | 48.15,77.65 48.15,77.91 | v48.16,77.97 48.16,77.66 48.15,77.65
+0_CUR  (via drill 0.7)
  Top 0.5: R49.1 107.42,18.49 Q4.C | R75.2 82.42,38.08 v82.39,38.05 v82.39,38.04
  Bottom 0.5: v82.39,38.04 82.39,35.24 84.08,33.55 103.99,33.55 104.85,32.69 104.85,19.18 105.56,18.47 Q4.C
+1V
  Top 0.5: IC10.9 IC10.8 42.94,80.63 44.01,81.7 R88.2
+5V  (via drill 0.7)
  Top 0.5: J2.9 54.51,90.07 55.42,89.16 | 55.42,89.16 55.42,89.09 | IC14.1 84.34,87.42 | C11.+ 88.4,92.73 85.66,92.73 85.06,92.13 85.06,88.14 84.34,87.42 | v83.68,87.37 84.29,87.37 84.34,87.42 | R94.2 39.12,91.83 | 39.12,91.83 39.12,92.1 39.1,92.08 v39.1,92.06 39.1,91.85 39.12,91.83 | v55.49,89.14 55.44,89.14 55.42,89.16 | 32.47,13.16 J1.8 32.47,7.58 33.01,7.04 39.61,7.04 40.09,7.52 J1.14 40.09,11.9 41.08,12.89 63.23,12.89 63.94,12.18 J3.12 J3.11 | 32.47,13.16 32.49,13.18 | v32.48,13.26 v32.47,13.25 32.47,13.16 | R27.2 31.61,20.08 31.92,19.77 v32.49,19.77 v32.5,19.78
  Bottom 0.5: v83.68,87.37 83.66,87.37 83.6,87.43 63.48,87.43 61.77,89.14 v55.49,89.14 55.39,89.24 55.39,91.24 54.52,92.11 39.05,92.11 | v39.1,92.06 39.05,92.11 | 39.05,92.11 36.46,92.11 34.28,94.29 6.73,94.29 3.09,90.65 3.09,16.88 6.71,13.26 v32.48,13.26 v32.49,13.27 v32.5,19.78
+12V  (via drill 0.7)
  Top 0.5: J2.8 51.97,99.51 52.65,100.19 68.67,100.19 69.7,99.16 C10.+ | C10.+ 72.97,92.91 73.81,92.07 73.81,88.11 74.5,87.42 IC14.8 76.59,85.55 v76.54,85.5 | IC5.11 27.79,62.22 v27.82,62.18 | IC2.11 45.62,66.94 v46.05,67.37 46.1,67.42 60.02,67.42 v59.99,67.45 v59.98,67.45 | v39.17,70.5 39.13,70.54 IC10.4 | IC22.4 53.05,76.34 v54.05,75.34 | v60.16,62.26 58.95,61.05 IC4.4 | v28.11,31.65 27.14,30.68 IC3.4 27.14,26.5 27.7,25.94 29.79,25.94 30.17,25.56 30.17,19.29 30.96,18.5 46.04,18.5 | IC8.11 89.48,49.45 v90.23,48.71 | IC9.11 110.27,49.76 v111.19,48.83 | IC24.4 105.1,70.09 v104,71.19 | IC1.7 48.76,37.45 v48.77,37.46 | R71.2 84.45,63.98 | 84.45,63.98 84.48,64.01 | v84.45,64.04 84.45,63.98 | R83.2 105.32,60.5 106.5,61.68 v111.19,61.68 | R68.2 83.87,37.05 83.49,36.67 80.8,36.67 79.65,37.82 79.65,48.7 v79.7,48.65 v79.7,48.64 | v100.67,48.87 100.67,48.8 100.66,48.79 100.66,37.9 101.47,37.09 104.04,37.09 104.68,37.73 R80.2 | C10.+ 69.7,92.55 69.86,92.39 | J3.10 J3.9 | 61.65,3.93 61.4,4.18 J3.9 | J1.11 37.55,2.15 38.18,1.52 46.39,1.52 | 46.39,1.52 60.64,1.52 61.4,2.28 J3.9 | 46.04,18.5 46.57,18.5 | v46.4,18.51 46.05,18.51 46.04,18.5 | v46.39,3.42 46.39,1.52 | IC7.4 97.51,19.91 98.28,20.68 v98.67,20.68
  Bottom 0.5: v27.82,62.18 27.82,69.35 28.97,70.5 v39.17,70.5 44.31,70.5 46.05,68.76 v46.05,67.37 | v54.05,75.34 58.21,75.34 59.96,73.59 59.96,68.11 | 59.96,68.11 59.96,67.36 | 59.96,67.36 59.96,62.46 v60.16,62.26 | v28.11,31.65 29.55,33.09 32.38,33.09 35.27,30.2 45.67,30.2 46.11,30.64 46.11,36.71 46.81,37.41 48.72,37.41 | 48.72,37.41 v48.77,37.46 | v111.19,61.68 111.24,61.54 | 111.24,61.54 111.19,61.49 v111.19,48.83 102.55,48.83 | v100.67,48.87 102.51,48.87 102.55,48.83 | 102.55,48.83 91.02,48.83 90.9,48.71 v90.23,48.71 79.63,48.71 v79.7,48.64 79.7,64.03 | v59.98,67.45 59.98,68.09 59.96,68.11 | 111.24,61.54 111.19,61.59 111.19,69.34 109.34,71.19 v104,71.19 104,84.11 102.61,85.5 v76.54,85.5 | v84.45,64.04 v84.44,64.03 79.7,64.03 | v46.4,18.51 46.4,3.52 | 46.4,3.52 46.38,3.5 | 46.4,3.52 v46.4,3.43 v46.39,3.42 72.22,3.42 73.56,4.76 73.56,19.36 74.88,20.68 v98.67,20.68 | 59.96,67.36 64.99,67.36 | 64.99,67.36 78.71,67.36 79.7,66.37 79.7,64.03 | 64.99,67.36 64.99,44.46 62.61,42.08 50.04,42.08 48.72,40.76 48.72,37.41
+90_CUR  (via drill 0.7)
  Top 0.5: Q9.C 87.84,34.42 R62.1 89.28,34.44 90.11,33.61 96.62,33.61 97.28,34.27 v97.28,37.97 | R87.2 v103.22,38.16 v103.21,38.15
  Bottom 0.5: v97.28,37.97 97.46,38.15 v103.21,38.15
-0_CUR
  Top 0.5: Q3.C 87.76,17.95 R50.1 81.27,20.29 77.82,23.74 77.82,54.91 79.16,56.25 R74.2
-1V
  Top 0.5: IC10.14 IC10.13 36.59,76.18 37,75.77 44.27,75.77 45.52,77.02 R89.2
-5V  (via drill 0.7)
  Top 0.5: J2.10 54.51,96.04 55.55,95 55.58,95 v55.6,94.98 | IC19.1 114.11,87.39 | C13.- 120.91,87.05 115.23,87.05 114.89,87.39 114.11,87.39 | v114.02,87.29 114.11,87.39 | v38.04,94.99 36.3,94.99 35.22,93.91 R96.2 11.59,85.32 9.44,83.17 9.44,15.95 9.41,15.92 v9.41,15.9 9.41,11.3 v9.22,11.11 | J1.10 35.01,13.21 | 35.01,13.21 35.02,13.22 | v35.03,13.29 35.01,13.27 35.01,13.21 | R15.1 28.73,21.14 v28.76,21.11
  Bottom 0.5: v114.02,87.29 114.02,93.69 112.73,94.98 v55.6,94.98 v55.59,94.99 v38.04,94.99 | v9.22,11.11 9.38,11.11 9.39,11.1 33.9,11.1 35.03,12.23 v35.03,13.29 35.03,20.37 34.37,21.03 28.84,21.03 | 28.84,21.03 28.73,21.03 | v28.76,21.11 28.84,21.03
-12V  (via drill 0.7)
  Top 0.5: IC19.8 103.38,87.39 102.92,86.93 99.49,86.93 C12.- 99.28,83.02 v99.26,83 | IC5.6 27.79,60.41 v27.87,60.49 | IC2.6 45.62,61.45 v45.59,61.47 | IC22.11 53.05,74.23 v51.92,75.36 | v57.82,62.2 58.95,63.33 IC4.11 | IC3.11 27.14,32.83 v25.95,31.64 | IC8.6 89.48,46.4 v90.31,47.22 | IC9.6 110.27,46.17 v111.24,47.15 | IC24.11 103,70.09 v104.07,69.02 | IC1.4 51.3,27.98 v51.41,27.86 | IC7.11 97.51,24.85 v98.22,25.56 | J3.2 51.24,6.86 | 51.24,6.86 J3.1 | v48.83,6.88 51.22,6.88 51.24,6.86 | IC10.11 39.13,81.08 v39.16,81.11 v39.16,81.12 | J2.11 57.05,81.98 v57.03,81.96 | v58.32,70.41 58.39,70.48 v61.83,70.48 65.89,70.48 67.5,68.87 67.5,27.83 67.53,27.8 | 67.53,27.8 v67.54,27.79 | v67.53,27.78 67.53,27.8
  Bottom 0.5: 58.38,72.83 58.38,62.76 v57.82,62.2 56.76,61.14 56.76,58.85 56.11,58.2 51.93,58.2 51,57.27 46.51,57.27 45.59,58.19 v45.59,61.47 41.3,61.47 40.32,60.49 v27.87,60.49 27.79,60.41 16.6,60.41 15.87,61.14 15.87,80.24 16.75,81.12 v39.16,81.12 | 58.38,72.83 57.38,73.83 53.08,73.83 51.92,74.99 v51.92,75.36 | v25.95,31.64 25.95,28.83 26.92,27.86 v51.41,27.86 | v111.24,47.15 111.17,47.22 v90.31,47.22 81.53,47.22 80.06,45.75 80.06,29.53 | 79.97,29.62 80.06,29.53 | 80.06,29.53 80.06,27.98 | 80.06,27.98 80.06,26.01 81.24,24.83 96.27,24.83 97.05,25.61 98.17,25.61 v98.22,25.56 | v48.83,6.88 48.83,6.97 48.84,6.98 48.84,16.8 51.41,19.37 v51.41,27.86 | v99.26,83 101.64,83 102.52,82.12 102.52,70.57 v104.07,69.02 62.95,69.02 61.83,70.14 v61.83,70.48 61.83,79.67 60.46,81.04 57.99,81.04 57.07,81.96 | 57.07,81.96 57.06,81.97 | v57.03,81.96 57.07,81.96 | v58.32,70.41 58.32,72.77 58.38,72.83 | 80.06,27.98 79.94,27.86 67.61,27.86 | 67.61,27.86 v51.41,27.86 | 67.61,27.86 v67.53,27.78
-90_CUR
  Top 0.5: Q7.C 107.42,33.02 R59.1 107.42,35.34 106.73,36.03 99.94,36.03 98.95,37.02 98.95,56.54 99.79,57.38 R86.2
GND  (via drill 0.7)
  Top 0.5: IC14.3 81.79,89.95 | 81.79,89.95 IC14.2 | IC19.7 IC19.6 IC19.3 IC19.2 | J2.15 J2.16 | IC14.7 IC14.6 76.61,89.95 81.79,89.95
  other vias: 119.79,67.88 119.59,52.73 23.42,50.82 32.28,53.63 48.51,61.32 39.67,51.81 42.53,51.58 47.04,51.65 12.53,42.95 6.88,29.81 109.04,69.63 49.53,87.35 7.56,89.91 24.07,75.06 85.03,93.72 108.13,81.9 89.08,70.47 99.24,60.31 16.45,48.39 57.68,6.97 119.56,38.72 55.1,53.21 55.81,43.39 52.01,39.5 6.82,19.94
  pour Top: 0,101.6 127,101.6 127,0 0,0
  pour Bottom: 0,101.6 127,101.6 127,0 0,0
LOGLIN2  (via drill 0.7)
  Top 0.5: 42.77,23.42 R1.1 | IC3.12 25.87,37.14 26.71,37.98 26.71,40.94 28.38,42.61 34.64,42.61 36.16,41.09 44.35,41.09 45.15,40.29 45.15,29 42.77,26.62 42.77,23.42 | J1.6 29.93,14.02 30.76,14.85 42.75,14.85 v42.72,14.82 v42.72,14.81 | 42.77,23.42 v42.77,22.21 v42.76,22.2
  Bottom 0.5: v42.72,14.81 42.72,22.16 v42.76,22.2
LOGLIN3  (via drill 0.7)
  Top 0.5: IC3.8 30.95,36.36 31.26,36.67 32.11,36.67 32.44,37 | 32.44,37 32.44,39.29 31.89,39.84 | 31.89,39.84 C7.- | R42.2 31.88,39.85 31.89,39.84 | v32.44,36.94 32.44,37 | J1.5 29.93,2.19 29.26,1.52 23.12,1.52 22.53,2.11 v22.53,18.82
  Bottom 0.5: v32.44,36.94 18.59,36.94 17.77,36.12 17.77,19.79 18.74,18.82 v22.53,18.82
MONO  (via drill 0.7)
  Top 0.5: v108.25,58.77 R85.2 | R76.2 107.62,38.24 107.65,38.27 v107.65,38.31 | 93.72,66.13 93.69,66.16 93.69,66.13 v93.67,66.11 93.67,74.25 94.3,74.88 C14.- 96.43,76.64 v96.47,76.68 | R73.2 v87.42,59.31 87.42,59.33 87.45,59.36 | R66.2 86.79,38.36 | 86.79,38.36 86.8,38.35 | v86.8,38.27 v86.79,38.28 86.79,38.36 | J2.7 51.97,90.47 52.36,90.08 v53.14,90.08 | v102.42,50.64 102.42,47.82 102.1,47.5 v102.1,45.6
  Bottom 0.5: v107.65,38.31 106.75,39.21 102.08,39.21 | 93.7,66.14 106.61,66.14 108.25,64.5 v108.25,58.77 103.14,58.77 102.38,58.01 102.38,50.73 102.42,50.69 | 93.7,66.14 93.69,66.14 | v87.42,59.31 87.42,64.94 88.59,66.11 v93.67,66.11 93.7,66.14 | v86.8,38.27 95.23,38.27 96.17,39.21 102.08,39.21 | v53.14,90.08 53.14,86.93 53.74,86.33 61.52,86.33 63.5,84.35 95.38,84.35 96.44,83.29 96.44,76.71 | 96.44,76.71 96.44,76.66 | v96.47,76.68 96.44,76.71 | 102.42,50.69 102.46,50.65 | 102.08,39.21 102.08,45.5 102.1,45.52 | 102.1,45.52 102.11,45.53 | v102.42,50.64 102.42,50.69 | v102.1,45.6 102.1,45.52
N$1
  Top 0.5: R98.2 C14.+
N$283
  Top 0.5: 23.08,24.52 C3.+ 22.09,24.6 R12.2 24.42,26.39 24.6,26.57 IC3.2 | 23.08,24.52 27.43,24.52 27.49,24.58 | R20.1 18.89,21.54 19.56,20.87 22.78,20.87 23.18,21.27 23.18,24.43 23.08,24.52 | R13.2 R14.2 27.49,24.58 | R15.2 27.49,24.58
N$284
  Top 0.5: C3.- 21.31,23.12 20.72,23.71 20.72,27.36 21.12,27.76 21.12,30.34 | 21.12,30.34 R25.1 21.09,31.7 21.09,28.88 21.14,28.93 | IC3.1 21.14,28.93 | 21.14,28.93 21.14,30.32 | 21.14,30.32 21.12,30.34 | R22.1 21.13,30.31 21.14,30.32
N$285  (via drill 0.7)
  Top 0.5: R25.2 R32.2 19.71,34.95 v20.12,35.36
  Bottom 0.5: v20.12,35.36 32.46,35.36 34.86,32.96 IC6.2
N$286
  Top 0.5: 33.45,23.17 C6.- 34.59,23.17 35.18,23.76 35.18,28.63 34.8,29.01 33.32,29.01 | R33.2 33.87,30.31 33.87,29.56 33.32,29.01 | 33.32,29.01 33.24,28.93 IC3.7 31.03,29.01 33.32,29.01
N$287
  Top 0.5: R33.1 35.85,31.79 36.15,31.49 36.15,29.93 36.62,29.46 38.64,29.46 39.05,29.87 IC6.3 IC6.4
N$290
  Top 0.5: R42.1 C7.+ | C7.+ 29.44,37.13 29.68,36.89 IC3.9 | C7.+ 28.34,38.44 27.93,38.85 27.93,40.93 28.42,41.42 33.13,41.42 34.06,40.48 34.06,38.38 35.08,37.37 38.98,37.37 IC6.6
N$341
  Top 0.5: R20.2 14.49,28.03 14.95,28.49 19.22,28.49 19.73,29 R22.2
N$344
  Top 0.5: R7.3 17.29,42.59 R10.1
N$345
  Top 0.5: IC6.1 35.38,35.39 32.96,35.39 32.39,34.82 32.39,32.43 31.91,31.95 30.28,31.95 29.68,31.35 IC3.6 29.68,27.4 30.29,26.79 31.29,26.79 31.61,26.47 R27.1 C6.+
N$347
  Top 0.5: R3.1 41.14,45.94 R4.2
N$348
  Top 0.5: Q5.E 82.21,10.13 R52.1
N$349
  Top 0.5: R24.1 24.92,52.46 R21.2
N$350
  Top 0.5: R98.1 R99.2
N$351  (via drill 0.7)
  Top 0.5: IC4.5 60.22,57.74 61.33,56.63 C9.- | C9.- C8.- 58.23,55.22 v57.63,54.62 | IC5.5 26.52,56.77 27.72,55.56 34.63,55.56 34.69,55.62 v34.82,55.62 | IC2.12 44.34,68.33 44.79,68.77 64.69,68.77 65.6,67.86 65.6,56.66 64.17,55.23 C9.-
  Bottom 0.5: v34.82,55.62 35.77,54.67 57.75,54.67 57.7,54.62 v57.63,54.62
N$353
  Top 0.5: R57.2 108.76,21.75 109.93,20.58 R56.3
N$356
  Top 0.5: IC24.7 106.62,73.93 R106.1 106.62,77.87 107.37,78.62 115.91,78.62 | R103.1 123.19,78.07 122.64,78.62 115.91,78.62 | C15.- 115.71,78.42 115.91,78.62
N$357
  Top 0.5: IC10.10 40.4,79.93 40.57,80.1 R95.2 40.55,83.96 R94.1
N$358
  Top 0.5: J2.1 44.35,89.18 44.01,88.84 R88.1
N$359
  Top 0.5: R96.1 36.67,83.92 R97.2 36.69,80.82 37.86,79.65 IC10.12
N$362
  Top 0.5: J2.2 44.35,95.9 45.65,94.6 45.65,88.39 45.52,88.26 R89.1
N$363
  Top 0.5: J2.5 49.43,89.33 50.98,87.78 52.24,87.78 52.45,87.56 R90.1
N$364
  Top 0.5: J2.6 49.43,95.59 50.66,94.36 50.66,89.71 51.59,88.78 53.39,88.78 53.89,88.28 R91.1
N$380
  Top 0.5: IC3.13 24.63,34.16 C1.+ D1.C R2.1
N$384
  Top 0.5: C1.- 24.63,41.45 24.22,41.86 22.66,41.86 D1.A 22.41,43.65 21.89,44.17 11.33,44.17 10.78,43.62 10.78,35.18 | 10.78,35.18 11.32,34.64 Q2.B | 10.78,35.18 10.78,30.82 11.57,30.03 17.8,30.03 18.48,30.71 18.48,31.88 18.51,31.91 18.51,35.92 19.52,36.93 22.9,36.93 23.33,36.5 IC3.14
N$399
  Top 0.5: IC1.2 48.76,25.96 | 48.76,25.96 C2.+ R5.1 | 48.76,25.96 48.68,26.04 D2.C 46.42,26.02 44.62,26.02 44.17,25.57 R1.2
N$414
  Top 0.5: R10.2 R2.2 19.46,39.91 19.15,39.6 19.15,38.66 17.17,36.68 17.17,32.53 16.74,32.1 Q2.E
N$418
  Top 0.5: D2.A 48.4,22.44 48.76,22.8 C2.- R5.2 54.03,23.44 55.03,24.44 R11.1 55.01,27.73 Q1.E Q1.B 50.79,32.81 50.02,33.58 IC1.6
N$419  (via drill 0.7)
  Top 0.5: R36.2 19.56,53.26 20.38,52.44 v20.5,52.44 21.94,52.44 R23.2
  Bottom 0.5: Q2.C 15.38,38.55 19.75,38.55 20.51,39.31 20.51,52.22 20.5,52.23 v20.5,52.44
N$420
  Top 0.5: R39.1 37,64.27 37.75,65.02 IC2.16
N$421
  Top 0.5: R9.1 45.5,47.36 R4.3 46.39,46.76 47.26,47.63 48.61,47.63 | 48.61,47.63 51.48,47.63 D4.C | 48.61,47.63 D3.A
N$428
  Top 0.5: IC2.3 41.8,57.44 41.12,56.75 41.12,54.61 | 41.12,54.61 R3.2 | R6.2 41.12,54.61
N$445
  Top 0.5: IC2.1 39.27,56.91 38.21,55.85 R17.1
N$484
  Top 0.5: IC2.4 43.08,56.47 42.53,55.92 42.53,54.65 R16.2 | R16.2 R19.1 | R18.1 R16.2
N$485  (via drill 0.7)
  Top 0.5: IC2.5 44.34,56.45 44.71,56.08 46.59,56.08 47.04,55.63 C4.- C5.- 48.74,54.57 v48.74,56.04 | IC4.3 57.68,57.33 57.27,56.92 54.64,56.92 | 54.64,56.92 54.34,56.92 | IC5.12 26.52,66.53 27.89,67.91 34.11,67.91 34.92,67.1 34.92,58.38 | 34.92,58.38 35.01,58.29 | v34.93,58.21 v34.92,58.22 34.92,58.38 | v54.35,56.95 54.61,56.95 54.64,56.92
  Bottom 0.5: v54.35,56.95 54.35,56.41 53.98,56.04 v48.74,56.04 37.1,56.04 v34.93,58.21
N$490
  Top 0.5: Q1.C 55.01,40.91 53.63,42.29 39.43,42.29 38.21,43.51 R17.2 37.42,53.21 37.41,53.2 37,53.61 R39.2
N$491
  Top 0.5: IC2.7 IC2.8
N$496
  Top 0.5: IC2.10 IC2.9
N$514
  Top 0.5: IC2.14 41.8,63.48 42.28,63.01 R35.2 R34.2
N$532
  Top 0.5: IC2.13 43.08,68.83 R38.2
N$551
  Top 0.5: IC5.13 25.25,67.94 R41.2
N$575
  Top 0.5: IC5.3 23.98,56.05 23.44,55.51 R26.2 R24.2
N$577
  Top 0.5: IC5.4 25.25,56.53 26.36,55.42 R29.1 R28.2 R30.1
N$584  (via drill 0.7)
  Top 0.5: R29.2 26.36,50.42 | 26.36,50.42 R31.2 | R31.2 | R37.1 18.05,52.9 20.1,50.85 21.32,50.85 22.94,49.23 22.94,45.45 23.7,44.69 26.46,44.69 26.94,45.17 26.94,47.35 26.36,47.93 R31.2 | IC4.6 IC4.7 v62.76,56.86 | v62.75,56.87 v62.76,56.86 | v62.76,56.86 62.76,56.85 | 28.58,50.42 | 28.58,50.42 26.36,50.42 | 28.58,50.42 29.69,50.42 v30.4,49.71
  Bottom 0.5: v30.4,49.71 30.4,48.78 33.95,45.23 60,45.23 62.75,47.98 v62.75,56.87
N$596
  Top 0.5: IC5.10 IC5.9
N$611
  Top 0.5: IC5.1 21.43,56.09 21.98,55.55 R23.1
N$615
  Top 0.5: R36.1 19.56,63.84 19.94,64.22 IC5.16
N$616
  Top 0.5: IC5.7 IC5.8
N$617
  Top 0.5: IC5.14 23.98,67.03 23.83,67.17 R40.2 18.8,67.99 18.05,67.24 R37.2
N$618
  Top 0.5: R31.1 29.08,49.23 29.41,48.9 29.41,47.81 R21.3 30.85,47.72 31.38,48.25 | 31.38,48.25 D6.C | D5.A 31.39,48.24 31.38,48.25
N$621
  Top 0.5: IC24.10 99.79,71.36 98.89,70.46 97.85,70.46 | 97.85,70.46 R99.1 | R100.2 97.82,70.43 97.85,70.46
N$622
  Top 0.5: IC24.9 IC24.8 R105.1
N$641
  Top 0.5: R101.2 121.77,71.97 R103.2
N$642
  Top 0.5: J2.13 59.59,82.93 61.8,80.72 104.38,80.72 105.22,79.88 R106.2
N$643  (via drill 0.7)
  Top 0.5: J2.14 59.59,95.8 60.98,94.41 60.98,84.64 60.98,83.76 62.44,82.3 85.09,82.3 85.06,82.27 v85.04,82.27 | R107.2 86.84,64.42 85.11,66.15 85.11,77.9 85.09,77.92 | 85.09,77.92 85.05,77.96 | v85.05,77.92 85.09,77.92
  Bottom 0.5: v85.04,82.27 v85.04,77.93 v85.05,77.92
N$644
  Top 0.5: J2.12 57.05,95.9 58.33,94.62 58.33,82.02 61.04,79.31 102.16,79.31 102.85,78.62 R105.2
N$645
  Top 0.5: 112.19,64.42 R107.1 IC24.1 | R104.1 112.68,63.93 112.19,64.42 | C16.- 111.96,64.65 112.19,64.42
N$646
  Top 0.5: D10.C D11.A
N$648
  Top 0.5: R102.2 113.21,68.33 R104.2
N$651
  Top 0.5: D11.C D12.A
N$652
  Top 0.5: D14.C D13.A
N$653
  Top 0.5: D15.C D14.A
N$654
  Top 0.5: D17.C D18.A
N$655
  Top 0.5: D16.C D17.A
N$656
  Top 0.5: D21.C D20.A
N$657
  Top 0.5: D20.C 26.39,92.08 D19.A
N$658  (via drill 0.7)
  Top 0.5: 54.28,77.95 IC22.3 54.32,80.47 v54.3,80.49 | R90.2 51.58,84.63 R92.2 49.98,84.62 v49.48,85.12 | D13.C 29.99,98.76 D10.A | 29.96,98.79 D13.C | D13.C 40,98.83 42.32,96.51 42.32,89.35 | v42.34,89.37 42.32,89.35 | 42.32,89.35 42.32,89.26
  Bottom 0.5: v42.34,89.37 42.34,85.72 42.94,85.12 v49.48,85.12 52.11,85.12 54.34,82.89 54.34,80.53 v54.3,80.49
N$659  (via drill 0.7)
  Top 0.5: R93.2 R91.2 53.89,82.98 51.78,80.87 | 51.85,77.98 IC22.5 51.78,80.87 | D19.C 30.09,91.98 | 30.09,91.98 D16.A | v31.88,91.95 30.12,91.95 30.09,91.98 | v51.76,80.89 51.78,80.87
  Bottom 0.5: v31.88,91.95 31.88,82.88 32.47,82.29 51.22,82.29 51.76,81.75 v51.76,80.89
N$668
  Top 0.5: IC8.1 83.14,43.03 82.42,42.32 R75.1
N$669
  Top 0.5: IC8.16 83.14,53.95 82.24,54.85 R74.1
N$670
  Top 0.5: IC8.3 85.67,42.74 85.33,42.4 R67.1 R66.1
N$671
  Top 0.5: IC8.2 84.41,42.91 83.87,42.37 R68.1
N$672
  Top 0.5: IC8.4 86.94,43.05 88.23,41.77 R69.1
N$673
  Top 0.5: IC8.7 IC8.8
N$675
  Top 0.5: IC8.10 IC8.9
N$676
  Top 0.5: IC8.14 85.67,53.01 85.9,53.23 85.9,54.81 R70.1
N$677
  Top 0.5: IC8.15 84.41,54.8 R71.1
N$678
  Top 0.5: IC8.13 86.94,52.81 87.42,53.29 R73.1 R72.1
N$679
  Top 0.5: R72.2 88.86,58.34 89.22,58.7 90.64,58.7 R65.3
N$680
  Top 0.5: R65.1 93.54,60.34 92.99,60.89 86.53,60.89 85.93,60.29 R70.2
N$682
  Top 0.5: R69.2 89.27,39.58 90.14,40.45 R64.3
N$683
  Top 0.5: R64.1 93.11,38.83 92.56,38.28 90.6,38.28 89.48,37.16 85.83,37.16 85.33,37.66 R67.2
N$684
  Top 0.5: R81.2 110.13,39.53 110.92,40.32 R77.3
N$685
  Top 0.5: R79.2 106.15,37.9 106.85,37.2 110.3,37.2 111.36,38.26 113.89,38.26 114.36,38.73 114.36,40.24 R77.1
N$686
  Top 0.5: R84.2 109.71,57.89 110.04,58.22 111.8,58.22 R78.3
N$687
  Top 0.5: R82.2 106.79,59.61 107.5,60.32 113.98,60.32 114.71,59.59 R78.1
N$688
  Top 0.5: IC9.14 106.45,53.73 106.84,54.12 106.84,55.94 R82.1
N$689
  Top 0.5: IC9.13 107.72,53.17 108.31,53.76 108.31,55.94 R85.1 R84.1
N$690
  Top 0.5: IC9.15 105.19,54.17 105.32,54.31 R83.1
N$691
  Top 0.5: IC9.16 103.92,55.91 R86.1
N$692
  Top 0.5: IC9.4 107.72,42.98 109.13,41.58 R81.1
N$693
  Top 0.5: IC9.3 106.45,42.65 106.15,42.34 R79.1 R76.1
N$694
  Top 0.5: IC9.2 105.19,43.08 104.68,42.57 R80.1
N$695
  Top 0.5: IC9.7 IC9.8
N$696
  Top 0.5: IC9.10 IC9.9
N$698
  Top 0.5: IC7.6 100.05,12.2 R44.2 R46.1
N$699
  Top 0.5: IC9.1 103.92,43.2 103.28,42.56 103.28,40.97 R87.1
N$701
  Top 0.5: IC7.7 101.32,16.62 102.01,15.93 Q4.B 114.37,15.93 Q6.B
N$702
  Top 0.5: Q4.E 107.44,11.37 106.85,10.78 R46.2 101.57,10.8 R51.2
N$703
  Top 0.5: Q6.E R53.2
N$704
  Top 0.5: D7.A 93.12,9.71 92.47,10.36 92.47,15.37 | IC7.1 93.13,17.95 92.47,17.29 92.47,15.37 | 92.47,15.37 Q3.B 87.73,15.44 Q5.B
N$705
  Top 0.5: R48.2 87.8,7.62 R47.3
N$706
  Top 0.5: IC7.2 94.97,13.55 D7.C 95.29,13.23 R45.1
N$708
  Top 0.5: 87.95,12.68 Q3.E R48.1 89.63,10.78 92.44,7.97 96.81,7.97 97.3,8.46 R45.2
N$711
  Top 0.5: IC7.13 94.97,25.3 93.74,26.53 D9.C R58.1 96.62,28.27 96.85,28.5 96.85,29.45 97.07,29.67 R54.2
N$712
  Top 0.5: IC7.14 93.7,24.55 91.59,26.66 91.59,29.53 | D9.A 92.27,31.86 91.59,31.18 91.59,29.53 | 91.59,29.53 91.49,29.63 Q9.B 87.8,29.67 Q10.B
N$716  (via drill 0.7)
  Top 0.5: Q9.E 87.97,26.96 R61.1 | R58.2 95.71,31.35 | 95.71,31.35 95.71,31.42 | v95.73,31.37 95.71,31.35
  Bottom 0.5: v95.73,31.37 95.73,27.93 94.89,27.09 Q9.E
N$717
  Top 0.5: Q10.E 82.04,27.1 R63.1
N$720
  Top 0.5: R55.1 99.69,28.31 | 99.69,28.31 D8.C | IC7.9 100.05,25.85 99.52,26.38 99.52,28.14 99.69,28.31
N$721
  Top 0.5: IC7.8 101.32,25.46 102.16,26.3 103.11,26.3 103.88,27.07 103.88,30.5 | D8.A 103.19,31.9 103.88,31.21 103.88,30.5 | 103.88,30.5 103.92,30.46 Q7.B 107.43,30.43 Q8.B
N$722  (via drill 0.7)
  Top 0.5: Q7.E 107.4,25.22 R57.1 | R55.2 99.54,33.91 100.35,34.72 104.33,34.72 v104.37,34.76
  Bottom 0.5: v104.37,34.76 109.6,34.76 110.72,33.64 110.72,28.3 110.34,27.92 Q7.E
N$725
  Top 0.5: Q8.E 113.29,25.3 R60.1
NORMHIGH1
  Top 0.5: J1.1 24.85,6.51 26.12,7.78 26.12,14.48 27.76,16.12 58.34,16.12 61.33,19.11 C9.+
NORMHIGH2  (via drill 0.7)
  Top 0.5: C5.+ 48.79,53.12 v48.79,51.66 | v58.31,46.74 58.33,20.43 58.33,18.26 57.35,17.28 26.92,17.28 24.85,15.21 J1.2
  Bottom 0.5: 58.31,46.72 v58.31,46.74 58.31,46.99 58.31,50.86 57.51,51.66 v48.79,51.66
OSC_X  (via drill 0.7)
  Top 0.5: 52.92,59.6 52.88,59.64 52.88,49.98 52.54,49.64 46,49.64 45.36,50.28 v43.99,50.28 | 53.85,59.6 52.92,59.6 | R34.1 51.82,60.08 52.3,59.6 52.92,59.6 | 53.85,59.6 IC4.2 IC4.1 | 53.85,59.6 53.85,63.99 51.83,66.01 49.91,66.01 v49.85,65.95 | R30.2 27.83,51.71 28.25,51.29 31.24,51.29 32.41,50.12 v36.61,50.12 | R18.2 44.03,50.32 v43.99,50.28 | R9.2 44.1,50.17 v43.99,50.28 | v46.65,71.66 46.89,71.9 J2.3
  Bottom 0.5: v49.85,65.95 48.67,65.95 47.93,66.69 47.93,71.23 47.5,71.66 v46.65,71.66 | v36.61,50.12 43.83,50.12 v43.99,50.28
OSC_Y  (via drill 0.7)
  Top 0.5: J2.4 46.89,95.87 48.24,94.52 v48.24,80.68 | 50.78,59.2 v50.76,59.18 v50.75,59.17 50.75,51.37 49.96,50.58 46.31,50.58 45.47,51.42 R19.2
  Bottom 0.5: v50.76,59.18 50.76,63.27 51.4,63.91 51.4,66.22 50.43,67.19 50.35,67.19 49.47,68.07 49.47,72.52 46.8,75.19 46.8,80.29 47.2,80.69 47.21,80.68 v48.24,80.68
X_SUM
  Top 0.5: IC8.5 IC8.12 88.22,52.27 88.71,52.76 94.4,52.76 95.69,54.05 95.69,61.61 97.05,62.97 111.87,62.97 112.91,61.93 117.5,61.93 118.4,62.83 118.4,69.02 117.32,70.1 114.33,70.1 R101.1 | IC24.6 108.59,72.63 109.25,71.97 R101.1 | R101.1 114.31,71.99 C15.+
Y_SUM  (via drill 0.7)
  Top 0.5: IC9.5 IC9.12 109,53.02 v109.72,53.74 | IC24.2 108.22,67.55 109.1,66.67 | R102.1 110.58,66.67 C16.+ 109.13,66.64 109.1,66.67 | v109.1,66.75 109.1,66.67
  Bottom 0.5: v109.1,66.75 109.72,66.13 v109.72,53.74